# Altium schematic sheet hud_v300_MAIN.SchDoc
size A4; SheetNumber: 1; SheetTotal: 6
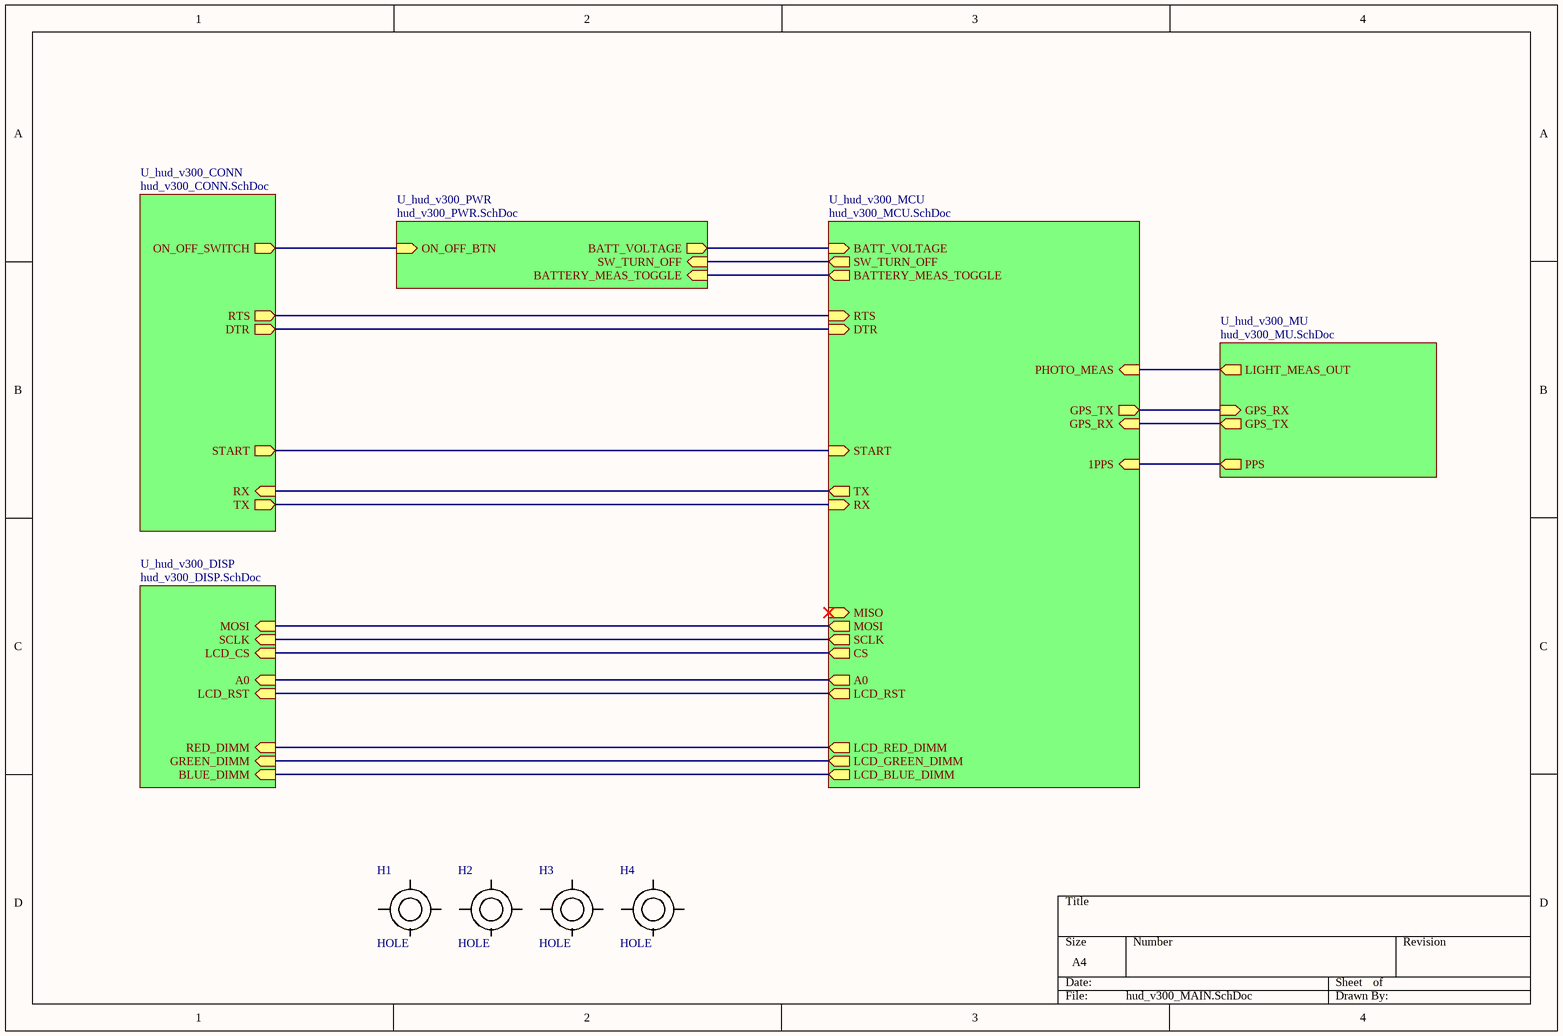
[diagram p0: hud_v300_MAIN.SchDoc]

## Parts
H1  HOLE  [HOLE_140_160MIL]
H2  HOLE  [HOLE_140_160MIL]
H3  HOLE  [HOLE_140_160MIL]
H4  HOLE  [HOLE_140_160MIL]

## Sub-sheets
U_hud_v300_CONN = hud_v300_CONN.SchDoc: RTS (out), DTR (out), TX (out), RX (in), ON_OFF_SWITCH (out), START (out)
U_hud_v300_DISP = hud_v300_DISP.SchDoc: MOSI (in), SCLK (in), RED_DIMM (in), GREEN_DIMM (in), BLUE_DIMM (in), A0 (in), LCD_CS (in), LCD_RST (in)
U_hud_v300_MCU = hud_v300_MCU.SchDoc: DTR (in), RTS (in), RX (in), TX (out), LCD_RED_DIMM (out), LCD_GREEN_DIMM (out), LCD_BLUE_DIMM (out), PHOTO_MEAS (in), SW_TURN_OFF (out), BATT_VOLTAGE (in), BATTERY_MEAS_TOGGLE (out), GPS_RX (in), GPS_TX (out), MOSI (out), MISO (in), SCLK (out), CS (out), LCD_RST (out), A0 (out), START (in), 1PPS (in)
U_hud_v300_MU = hud_v300_MU.SchDoc: PPS (out), LIGHT_MEAS_OUT (out), GPS_TX (out), GPS_RX (in)
U_hud_v300_PWR = hud_v300_PWR.SchDoc: BATTERY_MEAS_TOGGLE (in), BATT_VOLTAGE (out), ON_OFF_BTN (in), SW_TURN_OFF (in)

## Nets
(unnamed): sheet U_hud_v300_CONN/RTS, sheet U_hud_v300_MCU/RTS
(unnamed): sheet U_hud_v300_CONN/DTR, sheet U_hud_v300_MCU/DTR
(unnamed): sheet U_hud_v300_CONN/TX, sheet U_hud_v300_MCU/RX
(unnamed): sheet U_hud_v300_CONN/RX, sheet U_hud_v300_MCU/TX
(unnamed): sheet U_hud_v300_CONN/ON_OFF_SWITCH, sheet U_hud_v300_PWR/ON_OFF_BTN
(unnamed): sheet U_hud_v300_CONN/START, sheet U_hud_v300_MCU/START
(unnamed): sheet U_hud_v300_DISP/MOSI, sheet U_hud_v300_MCU/MOSI
(unnamed): sheet U_hud_v300_DISP/SCLK, sheet U_hud_v300_MCU/SCLK
(unnamed): sheet U_hud_v300_DISP/RED_DIMM, sheet U_hud_v300_MCU/LCD_RED_DIMM
(unnamed): sheet U_hud_v300_DISP/GREEN_DIMM, sheet U_hud_v300_MCU/LCD_GREEN_DIMM
(unnamed): sheet U_hud_v300_DISP/BLUE_DIMM, sheet U_hud_v300_MCU/LCD_BLUE_DIMM
(unnamed): sheet U_hud_v300_DISP/A0, sheet U_hud_v300_MCU/A0
(unnamed): sheet U_hud_v300_DISP/LCD_CS, sheet U_hud_v300_MCU/CS
(unnamed): sheet U_hud_v300_DISP/LCD_RST, sheet U_hud_v300_MCU/LCD_RST
(unnamed): sheet U_hud_v300_MCU/PHOTO_MEAS, sheet U_hud_v300_MU/LIGHT_MEAS_OUT
(unnamed): sheet U_hud_v300_MCU/SW_TURN_OFF, sheet U_hud_v300_PWR/SW_TURN_OFF
(unnamed): sheet U_hud_v300_MCU/BATT_VOLTAGE, sheet U_hud_v300_PWR/BATT_VOLTAGE
(unnamed): sheet U_hud_v300_MCU/BATTERY_MEAS_TOGGLE, sheet U_hud_v300_PWR/BATTERY_MEAS_TOGGLE
(unnamed): sheet U_hud_v300_MCU/GPS_RX, sheet U_hud_v300_MU/GPS_TX
(unnamed): sheet U_hud_v300_MCU/GPS_TX, sheet U_hud_v300_MU/GPS_RX
(unnamed): sheet U_hud_v300_MCU/1PPS, sheet U_hud_v300_MU/PPS